# Altium schematic sheet LMAT_AMT_V3.SchDoc
size C
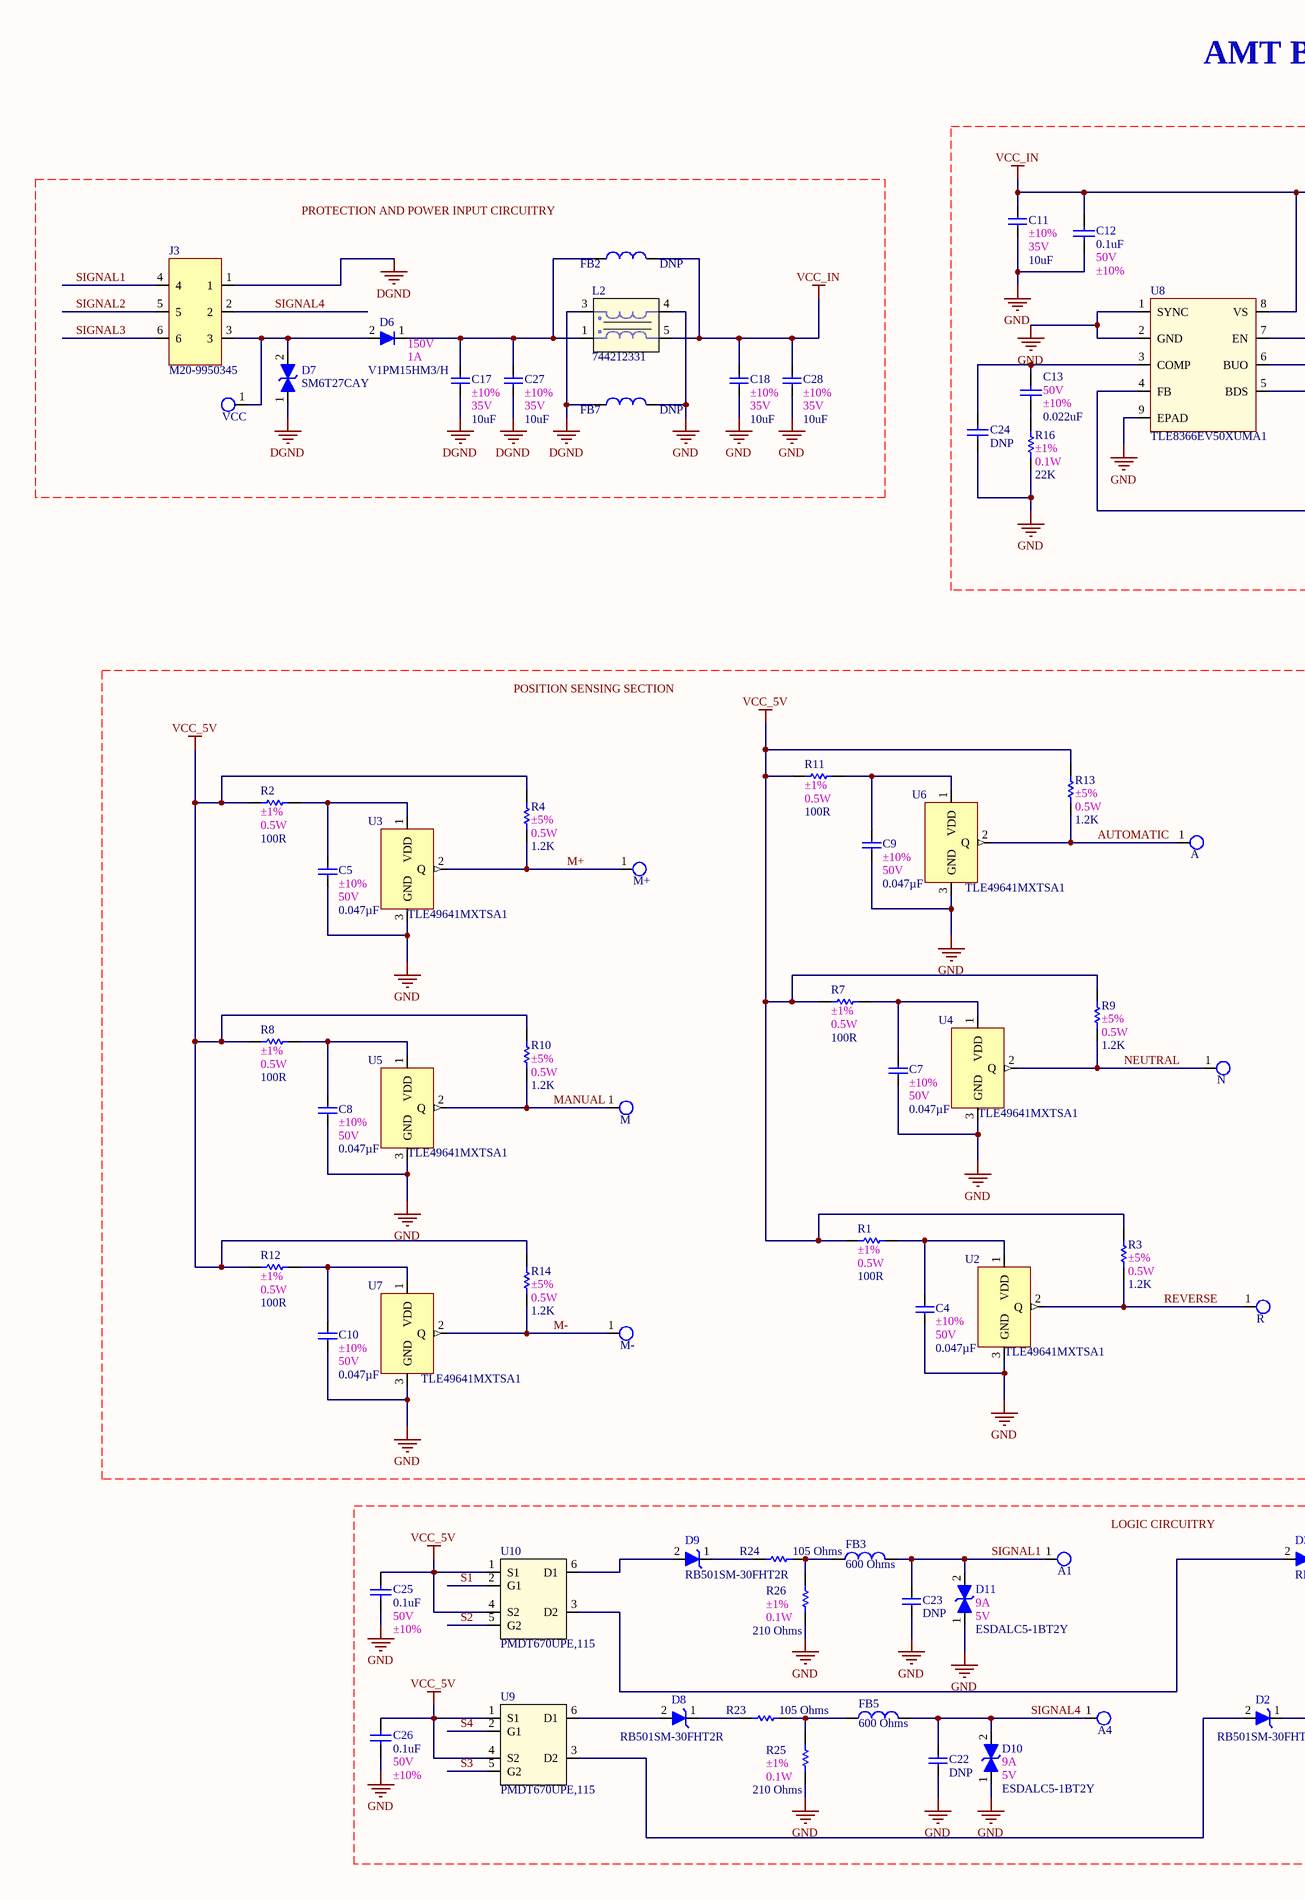
[diagram p0: LMAT_AMT_V3.SchDoc, left]
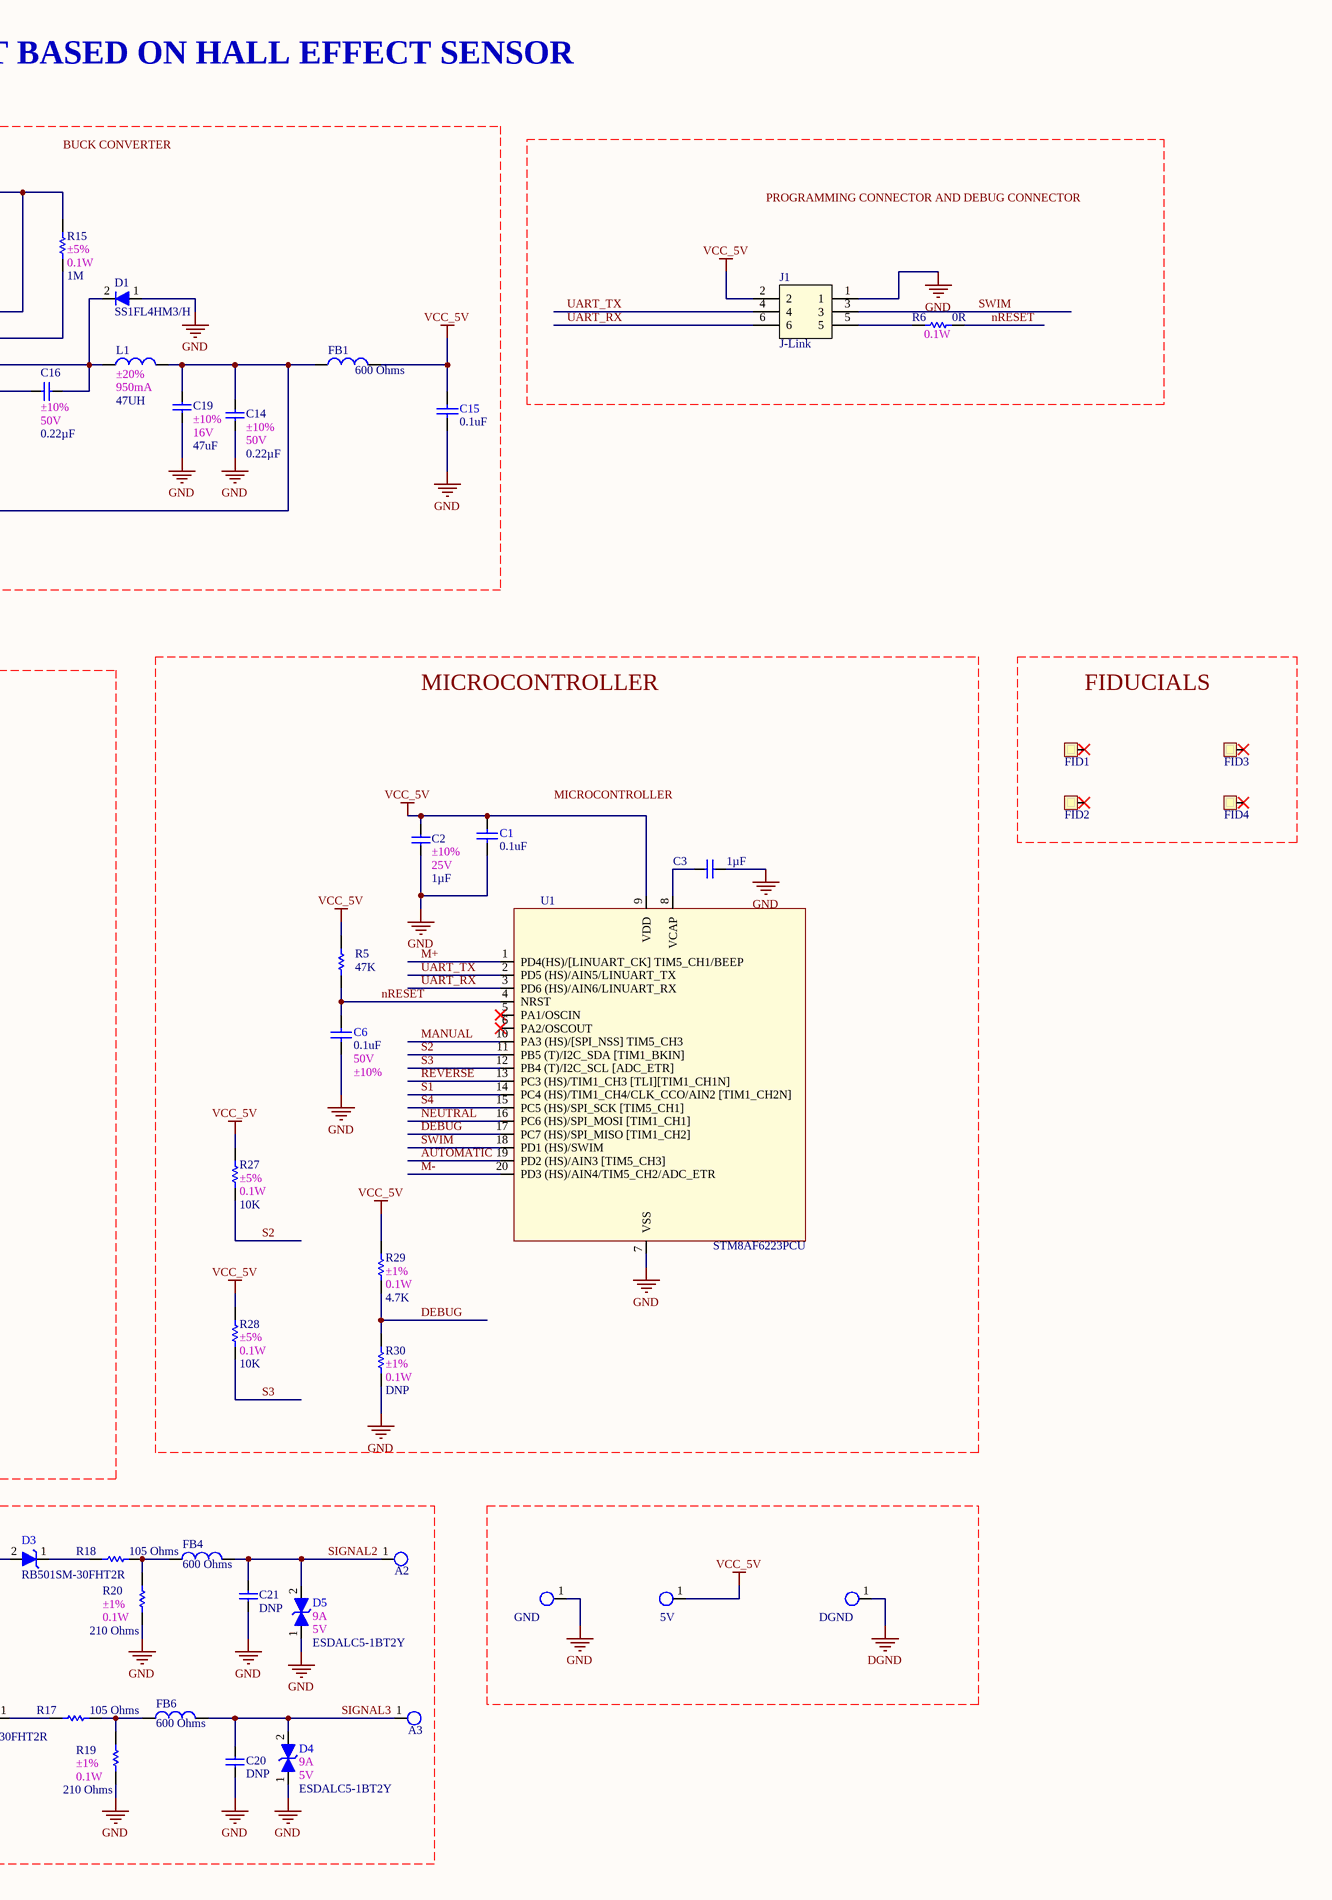
[diagram p1: LMAT_AMT_V3.SchDoc, right]

## Parts
5V  Test Point- 35mil  [TP_35M_DIA]  (value not drawn)
A  Test Point- 35mil  [TP_35M_DIA]  (value not drawn)
A1  Test Point- 35mil  [TP_35M_DIA]  (value not drawn)
A2  Test Point- 35mil  [TP_35M_DIA]  (value not drawn)
A3  Test Point- 35mil  [TP_35M_DIA]  (value not drawn)
A4  Test Point- 35mil  [TP_35M_DIA]  (value not drawn)
C1  value 0.1uF  [SMDC0603]  (hidden comment: CAP CER 0.1UF 50V 10% X7R 0603)
C2  value 1µF  2nd Auxiliary Field: ±10%  1st Auxiliary Field: 25V  [SMDC0603]  (hidden comment: CAP CER 1UF 25V X7R 0603)
C3  value 1µF  [SMDC0603]  (hidden comment: CAP CER 1UF 25V X7R 0603)
C4  value 0.047µF  2nd Auxiliary Field: ±10%  1st Auxiliary Field: 50V  [SMDC0603]  (hidden comment: CAP CER 0.047UF 50V X7R 0603)
C5  value 0.047µF  2nd Auxiliary Field: ±10%  1st Auxiliary Field: 50V  [SMDC0603]  (hidden comment: CAP CER 0.047UF 50V X7R 0603)
C6  value 0.1uF  1st Auxiliary Field: 50V  2nd Auxiliary Field: ±10%  [SMDC0603]  (hidden comment: CAP CER 0.1UF 50V 10% X7R 0603)
C7  value 0.047µF  2nd Auxiliary Field: ±10%  1st Auxiliary Field: 50V  [SMDC0603]  (hidden comment: CAP CER 0.047UF 50V X7R 0603)
C8  value 0.047µF  2nd Auxiliary Field: ±10%  1st Auxiliary Field: 50V  [SMDC0603]  (hidden comment: CAP CER 0.047UF 50V X7R 0603)
C9  value 0.047µF  2nd Auxiliary Field: ±10%  1st Auxiliary Field: 50V  [SMDC0603]  (hidden comment: CAP CER 0.047UF 50V X7R 0603)
C10  value 0.047µF  2nd Auxiliary Field: ±10%  1st Auxiliary Field: 50V  [SMDC0603]  (hidden comment: CAP CER 0.047UF 50V X7R 0603)
C11  value 10uF  2nd Auxiliary Field: ±10%  1st Auxiliary Field: 35V  [SMDC1206]  (hidden comment: CAP CER 10UF 35V X7R 1206)
C12  value 0.1uF  1st Auxiliary Field: 50V  2nd Auxiliary Field: ±10%  [SMDC0603]  (hidden comment: CAP CER 0.1UF 50V 10% X7R 0603)
C13  value 0.022uF  1st Auxiliary Field: 50V  2nd Auxiliary Field: ±10%  [SMDC0603]  (hidden comment: CAP CER 0.022UF 50V 10% X7R 0603)
C14  value 0.22µF  2nd Auxiliary Field: ±10%  1st Auxiliary Field: 50V  [SMDC0603]  (hidden comment: CAP CER 0.22UF 50V X7R 0603)
C15  value 0.1uF  [SMDC0603]  (hidden comment: CAP CER 0.1UF 50V 10% X7R 0603)
C16  value 0.22µF  2nd Auxiliary Field: ±10%  1st Auxiliary Field: 50V  [SMDC0603]  (hidden comment: CAP CER 0.22UF 50V X7R 0603)
C17  value 10uF  2nd Auxiliary Field: ±10%  1st Auxiliary Field: 35V  [SMDC1206]  (hidden comment: CAP CER 10UF 35V X7R 1206)
C18  value 10uF  2nd Auxiliary Field: ±10%  1st Auxiliary Field: 35V  [SMDC1206]  (hidden comment: CAP CER 10UF 35V X7R 1206)
C19  value 47uF  2nd Auxiliary Field: ±10%  1st Auxiliary Field: 16V  [SMDC1210]  (hidden comment: CAP CER 47UF 16V X6S 1210)
C20  value DNP  [SMDC0603]  (hidden comment: CAP CER 10000PF 50V X8R 0603)
C21  value DNP  [SMDC0603]  (hidden comment: CAP CER 10000PF 50V X8R 0603)
C22  value DNP  [SMDC0603]  (hidden comment: CAP CER 10000PF 50V X8R 0603)
C23  value DNP  [SMDC0603]  (hidden comment: CAP CER 10000PF 50V X8R 0603)
C24  value DNP  [SMDC0603]  (hidden comment: CAP CER 0.022UF 50V 10% X7R 0603)
C25  value 0.1uF  1st Auxiliary Field: 50V  2nd Auxiliary Field: ±10%  [SMDC0603]  (hidden comment: CAP CER 0.1UF 50V 10% X7R 0603)
C26  value 0.1uF  1st Auxiliary Field: 50V  2nd Auxiliary Field: ±10%  [SMDC0603]  (hidden comment: CAP CER 0.1UF 50V 10% X7R 0603)
C27  value 10uF  2nd Auxiliary Field: ±10%  1st Auxiliary Field: 35V  [SMDC1206]  (hidden comment: CAP CER 10UF 35V X7R 1206)
C28  value 10uF  2nd Auxiliary Field: ±10%  1st Auxiliary Field: 35V  [SMDC1206]  (hidden comment: CAP CER 10UF 35V X7R 1206)
D1  value SS1FL4HM3/H  [SODFL370X110-2N]  (hidden comment: DIODE SCHOTTKY 40V 1A DO-219AB)
D2  value RB501SM-30FHT2R  [SOD1700X70N-V2]  (hidden comment: Diode Schottky 30V 100mA Surface Mount EMD2)
D3  value RB501SM-30FHT2R  [SOD1700X70N-V2]  (hidden comment: Diode Schottky 30V 100mA Surface Mount EMD2)
D4  value ESDALC5-1BT2Y  2nd Auxiliary Field: 9A  1st Auxiliary Field: 5V  [SOD1510X40]  (hidden comment: TVS DIODE 5V 17.5V SOD882T)
D5  value ESDALC5-1BT2Y  2nd Auxiliary Field: 9A  1st Auxiliary Field: 5V  [SOD1510X40]  (hidden comment: TVS DIODE 5V 17.5V SOD882T)
D6  value V1PM15HM3/H  1st Auxiliary Field: 150V  2nd Auxiliary Field: 1A  [MICROSMP (DO-219AD)]  (hidden comment: DIODE SCHOTTKY 150V 1A MICROSMP)
D7  value SM6T27CAY  [DIOM4336X26B]  (hidden comment: TVS DIODE 23.1V 48.3V SMB)
D8  value RB501SM-30FHT2R  [SOD1700X70N-V2]  (hidden comment: Diode Schottky 30V 100mA Surface Mount EMD2)
D9  value RB501SM-30FHT2R  [SOD1700X70N-V2]  (hidden comment: Diode Schottky 30V 100mA Surface Mount EMD2)
D10  value ESDALC5-1BT2Y  2nd Auxiliary Field: 9A  1st Auxiliary Field: 5V  [SOD1510X40]  (hidden comment: TVS DIODE 5V 17.5V SOD882T)
D11  value ESDALC5-1BT2Y  2nd Auxiliary Field: 9A  1st Auxiliary Field: 5V  [SOD1510X40]  (hidden comment: TVS DIODE 5V 17.5V SOD882T)
DGND  Test Point- 35mil  [TP_35M_DIA]  (value not drawn)
FB1  value 600 Ohms  [SMDL0603]  (hidden comment: FERRITE BEAD 600 OHM 0603 1LN)
FB2  value DNP  [SMDL0603]  (hidden comment: FERRITE BEAD 600 OHM 0603 1LN)
FB3  value 600 Ohms  [SMDL0603]  (hidden comment: FERRITE BEAD 600 OHM 0603 1LN)
FB4  value 600 Ohms  [SMDL0603]  (hidden comment: FERRITE BEAD 600 OHM 0603 1LN)
FB5  value 600 Ohms  [SMDL0603]  (hidden comment: FERRITE BEAD 600 OHM 0603 1LN)
FB6  value 600 Ohms  [SMDL0603]  (hidden comment: FERRITE BEAD 600 OHM 0603 1LN)
FB7  value DNP  [SMDL0603]  (hidden comment: FERRITE BEAD 600 OHM 0603 1LN)
FID1  FID40X40  [FID40X40]  (value not drawn)
FID2  FID40X40  [FID40X40]  (value not drawn)
FID3  FID40X40  [FID40X40]  (value not drawn)
FID4  FID40X40  [FID40X40]  (value not drawn)
GND  Test Point- 35mil  [TP_35M_DIA]  (value not drawn)
J1  1st Auxiliary Field: J-Link  [PRG_8.06.16 J-LINK 6-PIN NEEDLE ADAPTER]  (hidden comment: J-LINK 6-PIN NEEDLE ADAPTER)
J3  Manufacturer Part Number: M20-9950345  [HDRRA6W86P254_2X3_1344X254X528P_Modified]  (hidden comment: CONN HEADER R/A 6POS 2.54MM)
L1  value 47UH  2nd Auxiliary Field: ±20%  1st Auxiliary Field: 950mA  [INDC4949X310N]  (hidden comment: FIXED IND 47UH 700MA 422.5 MOHM)
L2  value 744212331  [EMS_744212331]  (hidden comment: CMC 330UH 300MA 2LN 2 KOHM SMD)
M  Test Point- 35mil  [TP_35M_DIA]  (value not drawn)
M+  Test Point- 35mil  [TP_35M_DIA]  (value not drawn)
M-  Test Point- 35mil  [TP_35M_DIA]  (value not drawn)
N  Test Point- 35mil  [TP_35M_DIA]  (value not drawn)
R  Test Point- 35mil  [TP_35M_DIA]  (value not drawn)
R1  value 100R  2nd Auxiliary Field: ±1%  1st Auxiliary Field: 0.5W  [SMDR0805]  (hidden comment: RES SMD 100 OHM 1% 1/2W 0805)
R2  value 100R  2nd Auxiliary Field: ±1%  1st Auxiliary Field: 0.5W  [SMDR0805]  (hidden comment: RES SMD 100 OHM 1% 1/2W 0805)
R3  value 1.2K  2nd Auxiliary Field: ±5%  1st Auxiliary Field: 0.5W  [SMDR0805]  (hidden comment: RES SMD 1.2K OHM 5% 1/2W 0805)
R4  value 1.2K  2nd Auxiliary Field: ±5%  1st Auxiliary Field: 0.5W  [SMDR0805]  (hidden comment: RES SMD 1.2K OHM 5% 1/2W 0805)
R5  value 47K  [SMDR0603]  (hidden comment: RES SMD 47K OHM 1% 1/10W 0603)
R6  value 0R  1st Auxiliary Field: 0.1W  [SMDR0603]  (hidden comment: RES SMD 0.0OHM JUMPER 1/10W 0603)
R7  value 100R  2nd Auxiliary Field: ±1%  1st Auxiliary Field: 0.5W  [SMDR0805]  (hidden comment: RES SMD 100 OHM 1% 1/2W 0805)
R8  value 100R  2nd Auxiliary Field: ±1%  1st Auxiliary Field: 0.5W  [SMDR0805]  (hidden comment: RES SMD 100 OHM 1% 1/2W 0805)
R9  value 1.2K  2nd Auxiliary Field: ±5%  1st Auxiliary Field: 0.5W  [SMDR0805]  (hidden comment: RES SMD 1.2K OHM 5% 1/2W 0805)
R10  value 1.2K  2nd Auxiliary Field: ±5%  1st Auxiliary Field: 0.5W  [SMDR0805]  (hidden comment: RES SMD 1.2K OHM 5% 1/2W 0805)
R11  value 100R  2nd Auxiliary Field: ±1%  1st Auxiliary Field: 0.5W  [SMDR0805]  (hidden comment: RES SMD 100 OHM 1% 1/2W 0805)
R12  value 100R  2nd Auxiliary Field: ±1%  1st Auxiliary Field: 0.5W  [SMDR0805]  (hidden comment: RES SMD 100 OHM 1% 1/2W 0805)
R13  value 1.2K  2nd Auxiliary Field: ±5%  1st Auxiliary Field: 0.5W  [SMDR0805]  (hidden comment: RES SMD 1.2K OHM 5% 1/2W 0805)
R14  value 1.2K  2nd Auxiliary Field: ±5%  1st Auxiliary Field: 0.5W  [SMDR0805]  (hidden comment: RES SMD 1.2K OHM 5% 1/2W 0805)
R15  value 1M  2nd Auxiliary Field: ±5%  1st Auxiliary Field: 0.1W  [SMDR0603]  (hidden comment: RES SMD 1M OHM 5% 1/10W 0603)
R16  value 22K  2nd Auxiliary Field: ±1%  1st Auxiliary Field: 0.1W  [SMDR0603]  (hidden comment: RES SMD 22K OHM 1% 1/10W 0603)
R17  value 105 Ohms  [SMDR0603]  (hidden comment: RES SMD 105 OHM 1% 1/10W 0603)
R18  value 105 Ohms  [SMDR0603]  (hidden comment: RES SMD 105 OHM 1% 1/10W 0603)
R19  value 210 Ohms  2nd Auxiliary Field: ±1%  1st Auxiliary Field: 0.1W  [SMDR0603]  (hidden comment: RES SMD 210 OHM 1% 1/10W 0603)
R20  value 210 Ohms  2nd Auxiliary Field: ±1%  1st Auxiliary Field: 0.1W  [SMDR0603]  (hidden comment: RES SMD 210 OHM 1% 1/10W 0603)
R23  value 105 Ohms  [SMDR0603]  (hidden comment: RES SMD 105 OHM 1% 1/10W 0603)
R24  value 105 Ohms  [SMDR0603]  (hidden comment: RES SMD 105 OHM 1% 1/10W 0603)
R25  value 210 Ohms  2nd Auxiliary Field: ±1%  1st Auxiliary Field: 0.1W  [SMDR0603]  (hidden comment: RES SMD 210 OHM 1% 1/10W 0603)
R26  value 210 Ohms  2nd Auxiliary Field: ±1%  1st Auxiliary Field: 0.1W  [SMDR0603]  (hidden comment: RES SMD 210 OHM 1% 1/10W 0603)
R27  value 10K  2nd Auxiliary Field: ±5%  1st Auxiliary Field: 0.1W  [SMDR0402]  (hidden comment: RES SMD 10K OHM 5% 1/10W 0402)
R28  value 10K  2nd Auxiliary Field: ±5%  1st Auxiliary Field: 0.1W  [SMDR0402]  (hidden comment: RES SMD 10K OHM 5% 1/10W 0402)
R29  value 4.7K  2nd Auxiliary Field: ±1%  1st Auxiliary Field: 0.1W  [SMDR0402]  (hidden comment: RES SMD 4.7K OHM 1% 1/10W 0402)
R30  value DNP  2nd Auxiliary Field: ±1%  1st Auxiliary Field: 0.1W  [SMDR0402]  (hidden comment: RES SMD 4.7K OHM 1% 1/10W 0402)
U1  value STM8AF6223PCU  [SOP65P640X120-20N]  (hidden comment: IC MCU 8BIT 8KB FLASH 20TSSOP)
U2  value TLE49641MXTSA1  [SOT95P248X115-3N]  (hidden comment: MAGNETIC SWITCH UNIPOLAR SOT23-3)
U3  value TLE49641MXTSA1  [SOT95P248X115-3N]  (hidden comment: MAGNETIC SWITCH UNIPOLAR SOT23-3)
U4  value TLE49641MXTSA1  [SOT95P248X115-3N]  (hidden comment: MAGNETIC SWITCH UNIPOLAR SOT23-3)
U5  value TLE49641MXTSA1  [SOT95P248X115-3N]  (hidden comment: MAGNETIC SWITCH UNIPOLAR SOT23-3)
U6  value TLE49641MXTSA1  [SOT95P248X115-3N]  (hidden comment: MAGNETIC SWITCH UNIPOLAR SOT23-3)
U7  value TLE49641MXTSA1  [SOT95P248X115-3N]  (hidden comment: MAGNETIC SWITCH UNIPOLAR SOT23-3)
U8  value TLE8366EV50XUMA1  [SOIC127P600X170_HS-9N]  (hidden comment: IC REG BUCK 5V 1.8A 8DSO)
U9  value PMDT670UPE,115  [SOTFL50P160X60-6N]  (hidden comment: MOSFET 2P-CH 20V 0.55A SOT666)
U10  value PMDT670UPE,115  [SOTFL50P160X60-6N]  (hidden comment: MOSFET 2P-CH 20V 0.55A SOT666)
VCC  Test Point- 35mil  [TP_35M_DIA]  (value not drawn)

## Nets
DGND: C17.1 C27.1 D7.1(ANODE) DGND.1 FB7.1 J3.1 L2.3
GND: C1.2 C2.1 C3.2 C4.1 C5.1 C6.2 C7.1 C8.1 C9.1 C10.1 C11.1 C12.2 C14.1 C15.2 C18.1 C19.1 C20.1 C21.1 C22.1 C23.1 C24.2 C25.2 C26.2 C28.1 D1.1(Cathode) D4.1 D5.1 D10.1 D11.1 FB7.2 GND.1 J1.1 L2.4 R16.1 R19.2 R20.2 R25.2 R26.2 R30.1 U1.7(VSS) U2.3(GND) U3.3(GND) U4.3(GND) U5.3(GND) U6.3(GND) U7.3(GND) U8.1(SYNC) U8.2(GND) U8.9(EPAD)
VCC_5V: 5V.1 C1.1 C2.2 C15.1 C25.1 C26.1 FB1.2 J1.2 R1.1 R2.1 R3.1 R4.1 R5.2 R7.1 R8.1 R9.1 R10.1 R11.1 R12.1 R13.1 R14.1 R27.2 R28.2 R29.2 U1.9(VDD) U9.1(S1) U9.4(S2) U10.1(S1) U10.4(S2)
VCC_IN: C11.2 C12.1 C18.2 C28.2 FB2.2 L2.5 R15.2 U8.8(VS)
AUTOMATIC: A.1 R13.2 U1.19(PD2_(HS)/AIN3_[TIM5_CH3]) U6.2(Q)
DEBUG: R29.1 R30.2 U1.17(PC7_(HS)/SPI_MISO_[TIM1_CH2])
M+: M+.1 R4.2 U1.1(PD4(HS)/[LINUART_CK]_TIM5_CH1/BEEP) U3.2(Q)
M-: M-.1 R14.2 U1.20(PD3_(HS)/AIN4/TIM5_CH2/ADC_ETR) U7.2(Q)
MANUAL: M.1 R10.2 U1.10(PA3_(HS)/[SPI_NSS]_TIM5_CH3) U5.2(Q)
NEUTRAL: N.1 R9.2 U1.16(PC6_(HS)/SPI_MOSI_[TIM1_CH1]) U4.2(Q)
nRESET: C6.1 R5.1 R6.2 U1.4(NRST)
REVERSE: R.1 R3.2 U1.13(PC3_(HS)/TIM1_CH3_[TLI][TIM1_CH1N]) U2.2(Q)
S1: U1.14(PC4_(HS)/TIM1_CH4/CLK_CCO/AIN2_[TIM1_CH2N]) U10.2(G1)
S2: R27.1 U1.11(PB5_(T)/I2C_SDA_[TIM1_BKIN]) U10.5(G2)
S3: R28.1 U1.12(PB4_(T)/I2C_SCL_[ADC_ETR]) U9.5(G2)
S4: U1.15(PC5_(HS)/SPI_SCK_[TIM5_CH1]) U9.2(G1)
SIGNAL1: A1.1 C23.2 D11.2 FB3.2 J3.4
SIGNAL2: A2.1 C21.2 D5.2 FB4.2 J3.5
SIGNAL3: A3.1 C20.2 D4.2 FB6.2 J3.6
SIGNAL4: A4.1 C22.2 D10.2 FB5.2 J3.2
SWIM: J1.3 U1.18(PD1_(HS)/SWIM)
UART_RX: J1.6 U1.3(PD6_(HS)/AIN6/LINUART_RX)
UART_TX: J1.4 U1.2(PD5_(HS)/AIN5/LINUART_TX)
NetC3_1: C3.1 U1.8(VCAP)
NetC4_2: C4.2 R1.2 U2.1(VDD)
NetC5_2: C5.2 R2.2 U3.1(VDD)
NetC7_2: C7.2 R7.2 U4.1(VDD)
NetC8_2: C8.2 R8.2 U5.1(VDD)
NetC9_2: C9.2 R11.2 U6.1(VDD)
NetC10_2: C10.2 R12.2 U7.1(VDD)
NetC13_1: C13.1 C24.1 U8.3(COMP)
NetC13_2: C13.2 R16.2
NetC14_2: C14.2 C19.2 FB1.1 L1.2 U8.4(FB)
NetC16_1: C16.1 U8.5(BDS)
NetC16_2: C16.2 D1.2(Anode) L1.1 U8.6(BUO)
NetC17_2: C17.2 C27.2 D6.1(Cathode) FB2.1 L2.1
NetD2_1: D2.1(CATHODE) R17.1
NetD2_2: D2.2(ANODE) U9.3(D2)
NetD3_1: D3.1(CATHODE) R18.1
NetD3_2: D3.2(ANODE) U10.3(D2)
NetD6_2: D6.2(Anode) D7.2(CATHODE) J3.3 VCC.1
NetD8_1: D8.1(CATHODE) R23.1
NetD8_2: D8.2(ANODE) U9.6(D1)
NetD9_1: D9.1(CATHODE) R24.1
NetD9_2: D9.2(ANODE) U10.6(D1)
NetFB3_1: FB3.1 R24.2 R26.1
NetFB4_1: FB4.1 R18.2 R20.1
NetFB5_1: FB5.1 R23.2 R25.1
NetFB6_1: FB6.1 R17.2 R19.1
NetJ1_5: J1.5 R6.1
NetR15_1: R15.1 U8.7(EN)

Not connected (* = marked no-connect by the designer): FID1 0*; FID2 0*; FID3 0*; FID4 0*; U1 5(PA1/OSCIN)* 6(PA2/OSCOUT)*

## Notes on the sheet
- AMT BASED ON HALL EFFECT SENSOR
- BUCK CONVERTER
- PROTECTION AND POWER INPUT CIRCUITRY
- PROGRAMMING CONNECTOR AND DEBUG CONNECTOR
- POSITION SENSING SECTION
- MICROCONTROLLER
- FIDUCIALS
- LOGIC CIRCUITRY

## Library data of the parts
5V A A1-A4 DGND GND M M+ M- N R VCC = EMS-TP35MIL-S: Internal Part Number: EMS-TP35MIL-S; Component Height (mm): *; Part Type: Test Point- 35mil; Vendor Name: *
C1 C6 C12 C15 C25 C26 = ECA0U10K50V0-SC: Manufacturer Part Number: CGA3E2X7R1H104K080AA; Manufacturer: TDK Corporation; Vendor Part Number: 445-5666-1-ND; 3rd Auxiliary Field: RoHS Compliant; Component Height (mm): 0.90mm; Vendor Name: Digi-Key; Internal Part Number: ECA0U10K50V0-SC; Part Type: CAP CER 0.1UF 50V X7R 0603; Temp Co: X7R
  C1 C15: 1st Auxiliary Field: 50V; 2nd Auxiliary Field: ±10%
C2 = ECA1U00L25V0-SC: Manufacturer: TDK Corporation; Vendor Part Number: 445-173628-1-ND; Manufacturer Part Number: CGA3E1X7R1E105K080AE; Vendor Name: Digi-Key; 3rd Auxiliary Field: RoHS Compliant; Component Height (mm): 0.95mm; Temp Co: -55°C ~ 125°C; Part Type: CAP CER 1UF 25V X7R 0603; Internal Part Number: ECA1U00L25V0-SC; 4th Auxiliary Field: *
C3 = ECA1U00L25V0-SC: Manufacturer: TDK Corporation; Vendor Part Number: 445-173628-1-ND; Manufacturer Part Number: CGA3E1X7R1E105K080AE; Vendor Name: Digi-Key; 3rd Auxiliary Field: RoHS Compliant; Component Height (mm): 0.95mm; Temp Co: -55°C ~ 125°C; 2nd Auxiliary Field: ±10%; Part Type: CAP CER 1UF 25V X7R 0603; Internal Part Number: ECA1U00L25V0-SC; 4th Auxiliary Field: *; 1st Auxiliary Field: 25V
C4 C5 C7-C10 = ECA47N0L50V-SC: Manufacturer: TDK Corporation; Vendor Part Number: 445-5664-1-ND; Manufacturer Part Number: CGA3E2X7R1H473K080AA; Vendor Name: Digi-Key; 3rd Auxiliary Field: RoHS Compliant; Component Height (mm): 0.9mm; Temp Co: -55°C ~ 125°C; Part Type: CAP CER 0.047UF 50V X7R 0603; Internal Part Number: ECA47N0L50V-SC; 4th Auxiliary Field: *
C11 C17 C18 C27 C28 = ECA10U0L35V0-SG: Manufacturer: TDK Corporation; Vendor Part Number: 445-174428-1-ND; Manufacturer Part Number: CGA5L1X7R1V106K160AC; Vendor Name: Digi-Key; 3rd Auxiliary Field: RoHS Compliant; 4th Auxiliary Field: AEC-Q200; Component Height (mm): 1.80mm; Temp Co: -55°C ~ 125°C; Part Type: CAP CER 10UF 35V X7R 1206; Internal Part Number: ECA10U0L35V0-SG
C13 C24 = ECA0U022K50V0-SC: Manufacturer Part Number: CGA3E2X7R1H223K080AA; Manufacturer: TDK Corporation; Vendor Part Number: 445-5663-1-ND; Vendor Name: Digi-Key; Component Height (mm): 0.90mm; Internal Part Number: ECA0U022K50V0-SC; Part Type: CAP CER 0.022UF 50V X7R 0603; Temp Co: X7R
  C24: 1st Auxiliary Field: 50V; 2nd Auxiliary Field: ±10%
C14 C16 = ECA0U22L50V0-SC: Manufacturer: Murata Electronics North America; Vendor Part Number: 490-14410-1-ND; Manufacturer Part Number: GCJ188R71H224KA01D; Vendor Name: Digi-Key; 3rd Auxiliary Field: RoHS Compliant; Component Height (mm): 0.90mm; Temp Co: -55°C ~ 125°C; Part Type: CAP CER 0.22UF 50V X7R 0603; Internal Part Number: ECA0U22L50V0-SC; 4th Auxiliary Field: *
C19 = ECA47U0L16V0-SH: Manufacturer: Murata Electronics North America; Vendor Part Number: 490-12494-1-ND; Manufacturer Part Number: GRT32EC81C476KE13L; Vendor Name: Digi-Key; 3rd Auxiliary Field: RoHS Compliant; 4th Auxiliary Field: AEC-Q200; Component Height (mm): 2.70mm; Temp Co: -55°C ~ 105°C; Part Type: CAP CER 47UF 16V X6S 1210; Internal Part Number: ECA47U0L16V0-SH
C20-C23 = ECA0U01L50V0-SC: Manufacturer: TDK Corporation; Vendor Part Number: 445-5892-1-ND; Manufacturer Part Number: CGA3E2X8R1H103K080AA; Vendor Name: Digi-Key; 3rd Auxiliary Field: RoHS Compliant; 4th Auxiliary Field: AEC-Q200; Component Height (mm): 0.80mm; Temp Co: -55°C ~ 150°C; 2nd Auxiliary Field: ±10%; Part Type: CAP CER 10000PF 50V X8R 0603; Internal Part Number: ECA0U01L50V0-SC; 1st Auxiliary Field: 50V
D1 = EDDVS1A0040V0-S: Manufacturer: Vishay Semiconductor Diodes Division; Vendor Part Number: SS1FL4HM3/HGICT-ND; 3rd Auxiliary Field: RoHS Compliant; Temp Co: -55°C ~ 150°C; Vendor Name: Digi-Key; Component Height (mm): 1.08mm; Manufacturer Part Number: SS1FL4HM3/H; Internal Part Number: EDDVS1A0040V0-S; Part Type: DIODE SCHOTTKY 40V 1A DO-219AB; 4th Auxiliary Field: *; 1st Auxiliary Field: 40V; 2nd Auxiliary Field: 1A
D2 D3 D8 D9 = EDDR0A1030V0-S: Manufacturer: Rohm Semiconductor; Vendor Part Number: RB501SM-30FHT2RCT-ND; 3rd Auxiliary Field: RoHS Compliant; Component Height (mm): 0.70mm; Temp Co: 125°C (Max); Vendor Name: Digi-Key; Manufacturer Part Number: RB501SM-30FHT2R; Internal Part Number: EDDR0A1030V0-S; Part Type: Diode Schottky 30V 100mA Surface Mount EMD2; 4th Auxiliary Field: *; 2nd Auxiliary Field: 100mA; 1st Auxiliary Field: 30V
D4 D5 D10 D11 = EDDST9A005V00-S: Manufacturer: STMicroelectronics; Vendor Part Number: 497-14998-1-ND; 3rd Auxiliary Field: RoHS Compliant; Component Height (mm): 0.40mm; Temp Co: -50°C ~ 125°C (TJ); 4th Auxiliary Field: AEC-Q101; Vendor Name: Digi-Key; Manufacturer Part Number: ESDALC5-1BT2Y; Internal Part Number: EDDST9A005V00-S; Part Type: TVS DIODE 5V 17.5V SOD882T
D6 = EDDVS1A00150V-S: Manufacturer: Vishay Semiconductor Diodes Division; Vendor Part Number: V1PM15HM3/HGICT-ND; 3rd Auxiliary Field: RoHS Compliant; Temp Co: -40°C ~ 175°C; 4th Auxiliary Field: AEC-Q101; Vendor Name: Digi-Key; Component Height (mm): 0.73mm; Manufacturer Part Number: V1PM15HM3/H; Internal Part Number: EDDVS1A00150V-S; Part Type: DIODE SCHOTTKY 150V 1A MICROSMP
D7 = EDDST83A025V7-S: Manufacturer: STMicroelectronics; Vendor Part Number: 497-10798-1-ND; 3rd Auxiliary Field: RoHS Compliant; Component Height (mm): 2.65mm; Temp Co: -55°C ~ 150°C (TJ); Vendor Name: Digi-Key; 2nd Auxiliary Field: 600W; 1st Auxiliary Field: 25.7V; Manufacturer Part Number: SM6T27CAY; Internal Part Number: EDDST83A025V7-S; Part Type: TVS DIODE 23.1V 48.3V SMB; 4th Auxiliary Field: *
FB1-FB7 = EIN600R1A00-SC: Manufacturer: Würth Elektronik; Manufacturer Part Number: 782633601; Vendor Part Number: 732-6703-1-ND; 3rd Auxiliary Field: ROHS3 Compliant; Component Height (mm): 1.00mm; 4th Auxiliary Field: AEC-Q200; Vendor Name: Digi-Key; Temp Co: -55°C ~ 125°C; 2nd Auxiliary Field: 600 Ohms @ 100MHz; 1st Auxiliary Field: 1A; Internal Part Number: EIN600R1A00-SC; Part Type: FERRITE BEAD 600 OHM 0603 1LN
FID1-FID4 = FID_40X40
J1 = EMS-8.06.16 J-LINK 6-PIN NEEDLE ADAPTER: Manufacturer: Segger Microcontroller Systems; Vendor Part Number: 899-1051-ND; 3rd Auxiliary Field: RoHS Compliant; Vendor Name: Digi-Key; 2nd Auxiliary Field: *; 4th Auxiliary Field: *; Internal Part Number: EMS-8.06.16 J-LINK 6-PIN NEEDLE ADAPTER; Part Type: J-LINK 6-PIN NEEDLE ADAPTER; Temp Co: *; Manufacturer Part Number: 8.06.16 J-LINK 6-PIN NEEDLE ADAPTER; Value: 8.06.16 J-LINK 6-PIN NEEDLE ADAPTER
J3 = ECN-M20-9950345-0003-0060: Manufacturer: Harwin Inc.; Vendor Part Number: 952-2092-ND; 2nd Auxiliary Field: 2 rows; 3rd Auxiliary Field: RoHS Compliant; Component Height (mm): 5.08mm; Temp Co: -40°C ~ 105°C; Vendor Name: Digi-Key; 1st Auxiliary Field: 6pos; Internal Part Number: ECN-M20-9950345-0003-0060; Part Type: CONN HEADER R/A 6POS 2.54MM; Value: M20-9950345; 4th Auxiliary Field: *
L1 = EIN47U0N950M-S: Manufacturer: Taiyo Yuden; Vendor Part Number: 587-3604-1-ND; Manufacturer Part Number: NRS5030T470MMGJV; Vendor Name: Digi-Key; 3rd Auxiliary Field: RoHS Compliant; 4th Auxiliary Field: AEC-Q200; Component Height (mm): 3.00mm; Temp Co: -40°C ~ 125°C; Part Type: FIXED IND 47UH 700MA 422.5 MOHM; Internal Part Number: EIN47U0N950M-S
L2 = EIN330U300M-S: Manufacturer: Würth Elektronik; Vendor Part Number: 732-3939-1-ND; 3rd Auxiliary Field: ROHS3 Compliant; Component Height (mm): 1.8mm; Vendor Name: Digi-Key; Temp Co: -40°C ~ 105°C; 2nd Auxiliary Field: 330µH @ 100kHz; Internal Part Number: EIN330U300M-S; Part Type: CMC 330UH 300MA 2LN 2 KOHM SMD; 4th Auxiliary Field: *; Manufacturer Part Number: 744212331; 1st Auxiliary Field: 300mA
R1 R2 R7 R8 R11 R12 = ERE100RG120-SE: Manufacturer Part Number: ERJ-P06F1000V; Manufacturer: Panasonic Electronic Components; Vendor Part Number: P16057CT-ND; Component Height (mm): 0.70mm; 3rd Auxiliary Field: RoHS Compliant; 4th Auxiliary Field: AEC-Q200; Vendor Name: Digi-Key; Temp Co: -55°C ~ 155°C; Part Type: RES SMD 100 OHM 1% 1/2W 0805; Internal Part Number: ERE100RG120-SE
R3 R4 R9 R10 R13 R14 = ERE1K20G102-SE: Manufacturer: Panasonic Electronic Components; Vendor Part Number: P1.2KADCT-ND; Manufacturer Part Number: ERJ-P06J122V; Vendor Name: Digi-Key; 3rd Auxiliary Field: RoHS Compliant; Component Height (mm): 0.70mm; Temp Co: -55°C ~ 155°C; Part Type: RES SMD 1.2K OHM 5% 1/2W 0805; Internal Part Number: ERE1K20G102-SE; 4th Auxiliary Field: *
R5 = ERE47K0G110-SC: Manufacturer: Yageo; Vendor Part Number: YAG2129CT-ND; Manufacturer Part Number: AT0603FRE0747KL; Vendor Name: Digi-Key; 3rd Auxiliary Field: RoHS Compliant; Component Height (mm): 0.55mm; Temp Co: -55°C ~ 155°C; 1st Auxiliary Field: 0.1W; Part Type: RES SMD 47K OHM 1% 1/10W 0603; Internal Part Number: ERE47K0G110-SC; 4th Auxiliary Field: *; 2nd Auxiliary Field: ±1%
R6 = ERE0R00110-SC: Manufacturer Part Number: ERJ-3GEY0R00V; Manufacturer: Panasonic Electronic Components; Vendor Part Number: P0.0GCT-ND; Component Height (mm): 0.55mm; Vendor Name: Digi-Key; Internal Part Number: ERE0R00110-SC; Part Type: RES SMD 0.0OHM JUMPER 1/10W 0603; Temp Co: *; 2nd Auxiliary Field: Jumper
R15 = ERE1M00K110-SC: Manufacturer: Vishay Dale; Vendor Part Number: 541-2216-1-ND; Manufacturer Part Number: RCA06031M00JNEA; Vendor Name: Digi-Key; 3rd Auxiliary Field: RoHS Compliant; 4th Auxiliary Field: AEC-Q200; Component Height (mm): 0.50mm; Temp Co: -55°C ~ 155°C; Part Type: RES SMD 1M OHM 5% 1/10W 0603; Internal Part Number: ERE1M00K110-SC
R16 = ERE22K0G110-SC: Manufacturer: Panasonic Electronic Components; Vendor Part Number: P22.0KHCT-ND; Manufacturer Part Number: ERJ-3EKF2202V; Vendor Name: Digi-Key; 3rd Auxiliary Field: RoHS Compliant; 4th Auxiliary Field: AEC-Q200; Component Height (mm): 0.55mm; Temp Co: -55°C ~ 155°C; Part Type: RES SMD 22K OHM 1% 1/10W 0603; Internal Part Number: ERE22K0G110-SC
R17 R18 R23 R24 = ERE105RG110-SC: Manufacturer: Panasonic Electronic Components; Vendor Part Number: P105HCT-ND; Manufacturer Part Number: ERJ-3EKF1050V; Vendor Name: Digi-Key; 3rd Auxiliary Field: RoHS Compliant; 4th Auxiliary Field: AEC-Q200; Component Height (mm): 0.55mm; Temp Co: -55°C ~ 155°C; 1st Auxiliary Field: 0.1W; Part Type: RES SMD 105 OHM 1% 1/10W 0603; Internal Part Number: ERE105RG110-SC; 2nd Auxiliary Field: ±1%
R19 R20 R25 R26 = ERE210RG110-SC: Manufacturer: Panasonic Electronic Components; Vendor Part Number: P210HCT-ND; Manufacturer Part Number: ERJ-3EKF2100V; Vendor Name: Digi-Key; 3rd Auxiliary Field: RoHS Compliant; 4th Auxiliary Field: AEC-Q200; Component Height (mm): 0.55mm; Temp Co: -55°C ~ 155°C; Part Type: RES SMD 210 OHM 1% 1/10W 0603; Internal Part Number: ERE210RG110-SC
R27 R28 = ERE10K0K110-SB: Manufacturer: Panasonic Electronic Components; Vendor Part Number: P10KJCT-ND; Manufacturer Part Number: ERJ-2GEJ103X; Vendor Name: Digi-Key; 3rd Auxiliary Field: RoHS Compliant; Component Height (mm): 0.40mm; Temp Co: ±200ppm/°C; Part Type: RES SMD 10K OHM 5% 1/10W 0402; Internal Part Number: ERE10K0K110-SB; 4th Auxiliary Field: *
R29 R30 = ERE4K70G110-SB: Manufacturer: Panasonic Electronic Components; Vendor Part Number: P4.70KLCT-ND; Manufacturer Part Number: ERJ-2RKF4701X; Alternate Part Number: RK73H1ETTP4701F; Vendor Name: Digi-Key; 3rd Auxiliary Field: RoHS Compliant; 4th Auxiliary Field: AEC-Q200; Component Height (mm): 0.40mm; Temp Co: ±100ppm/°C; Part Type: RES SMD 4.7K OHM 1% 1/10W 0402; Internal Part Number: ERE4K70G110-SB
U1 = EICSTMTSSOP-20-1691: Manufacturer: STMicroelectronics; Vendor Part Number: 497-17896-ND; Component Height (mm): 1.2mm; 3rd Auxiliary Field: RoHS Compliant; Vendor Name: Digi-Key; Temp Co: -40°C ~ 125°C (TA); 2nd Auxiliary Field: 8-Bit; 1st Auxiliary Field: 3V ~ 5.5V; Manufacturer Part Number: STM8AF6223PCU; Part Type: IC MCU 8BIT 8KB FLASH 20TSSOP; 4th Auxiliary Field: *; Internal Part Number: EICSTMTSSOP-20-1691
U2-U7 = EICITSOT23-3-1528: Manufacturer: Infineon Technologies; Vendor Part Number: TLE49641MXTSA1CT-ND; Vendor Name: Digi-Key; 3rd Auxiliary Field: RoHS Compliant; Component Height (mm): 1.15mm; Temp Co: -40°C ~ 170°C (TJ); 2nd Auxiliary Field: 2.5mA; 1st Auxiliary Field: 3 V ~ 32 V; Part Type: MAGNETIC SWITCH UNIPOLAR SOT23-3; Internal Part Number: EICITSOT23-3-1528; 4th Auxiliary Field: *; Manufacturer Part Number: TLE49641MXTSA1
U8 = EICITSOIC-08-0001: Manufacturer: Infineon Technologies; Vendor Part Number: TLE8366EV50XUMA1CT-ND; Component Height (mm): 1.7mm; 3rd Auxiliary Field: RoHS Compliant; 4th Auxiliary Field: AEC-Q100; Vendor Name: Digi-Key; Temp Co: -40°C ~ 150°C (TJ); 1st Auxiliary Field: 45V; Manufacturer Part Number: TLE8366EV50XUMA1; Part Type: IC REG BUCK 5V 1.8A 8DSO; Internal Part Number: EICITSOIC-08-0001; 2nd Auxiliary Field: 1.8A
U9 U10 = EICNUSOT666-06-0004: Manufacturer: Nexperia USA Inc.; Vendor Part Number: 1727-1334-1-ND; Component Height (mm): 0.6mm; 3rd Auxiliary Field: RoHS Compliant; 4th Auxiliary Field: AEC-Q101; Vendor Name: Digi-Key; Temp Co: -55°C ~ 150°C (TJ); 2nd Auxiliary Field: 550mA; Manufacturer Part Number: PMDT670UPE,115; Part Type: MOSFET 2P-CH 20V 0.55A SOT666; Internal Part Number: EICNUSOT666-06-0004; 1st Auxiliary Field: 20V